# EAGLE design untitled (EAGLE 9.6.2)
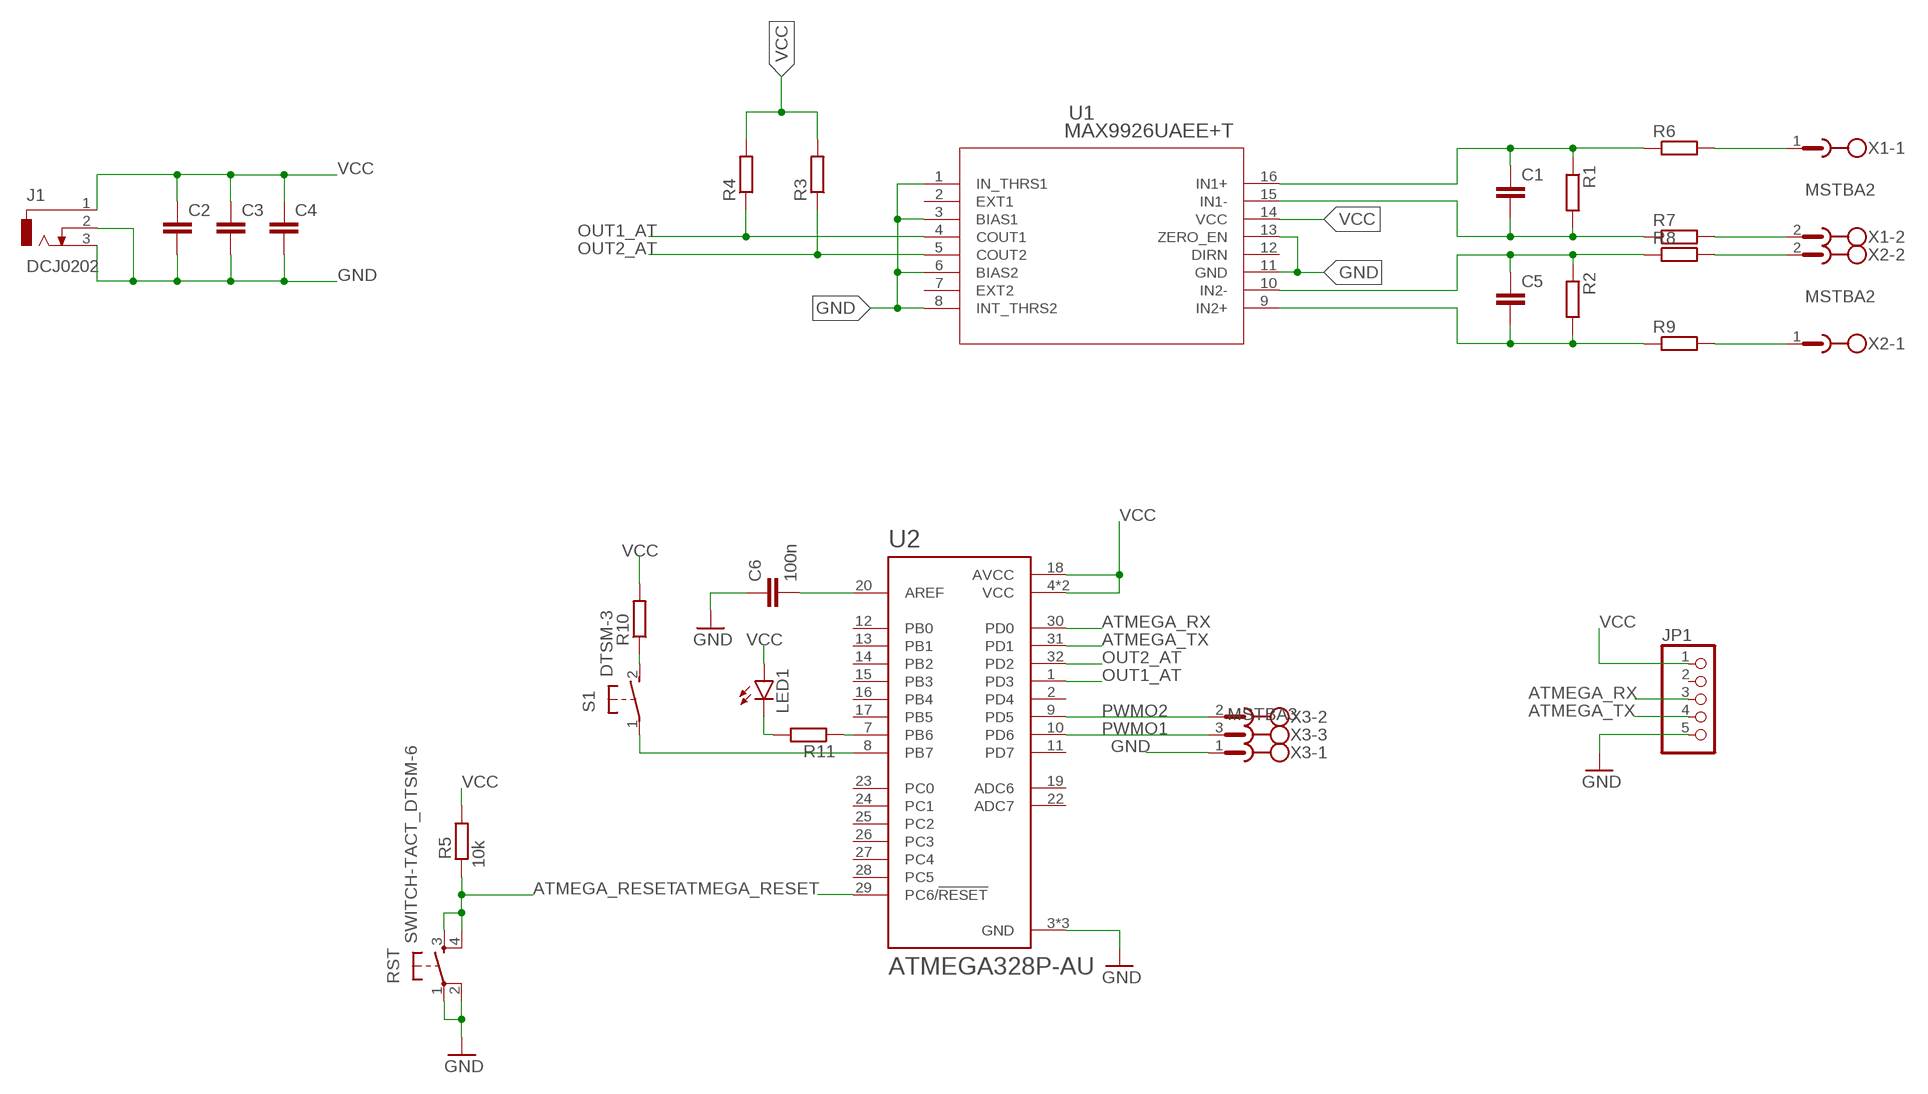
[diagram p0: schematic, sheet 1]

## Parts
C1  C-EUC0805  [C0805]
C2  C-EUC0805  [C0805]
C3  C-EUC0805  [C0805]
C4  C-EUC0805  [C0805]
C5  C-EUC0805  [C0805]
C6  100n  C-EUC0805  [C0805]
J1  DCJ0202  [DCJ0202]
JP1  PINHD-1X5  [1X05]
LED1  LEDCHIP-LED0805  [CHIP-LED0805]
R1  R-EU_R1206  [R1206]
R2  R-EU_R1206  [R1206]
R3  R-EU_R1206  [R1206]
R4  R-EU_R1206  [R1206]
R5  10k  R-EU_R1206  [R1206]
R6  R-EU_R2512  [R2512]
R7  R-EU_R2512  [R2512]
R8  R-EU_R2512  [R2512]
R9  R-EU_R2512  [R2512]
R10  R-EU_R1206  [R1206]
R11  R-EU_R1206  [R1206]
RST  SWITCH-TACT_DTSM-6  [SWITCH-TACT_DTSM-6]
S1  DTSM-3  [DTSM-3]
U1  MAX9926UAEE+T  [21-0055H_16_MXM]
U2  ATMEGA328P-AU  [QFP80P900X900X120-32N]
X1  MSTBA2  [MSTBA2]
X2  MSTBA2  [MSTBA2]
X3  MSTBA3  [MSTBA3]

## Nets
ATMEGA_RESET: R5.1 RST.3 RST.4 U2.29(PC6/!RESET)
ATMEGA_RX: JP1.3 U2.30(PD0)
ATMEGA_TX: JP1.4 U2.31(PD1)
GND: C2.2 C3.2 C4.2 C6.1 J1.2 J1.3 JP1.5 RST.1 RST.2 U1.1(IN_THRS1) U1.3(BIAS1) U1.6(BIAS2) U1.8(INT_THRS2) U1.11(GND) U1.13(ZERO_EN) U2.3(GND) U2.5(GND) U2.21(GND) X3.1
IN1+: R6.2 X1.1
IN1-: R7.2 X1.2
IN2+: R9.2 X2.1
IN2-: R8.2 X2.2
N$1: LED1.C R11.2
N$2: R10.1 S1.2
N$3: C1.1 R1.1 R6.1 U1.16(IN1+)
N$4: C1.2 R1.2 R7.1 U1.15(IN1-)
N$5: S1.1 U2.8(PB7)
N$6: C6.2 U2.20(AREF)
N$7: R11.1 U2.7(PB6)
N$8: C5.1 R2.1 R8.1 U1.10(IN2-)
N$9: C5.2 R2.2 R9.1 U1.9(IN2+)
OUT1_AT: R4.1 U1.4(COUT1) U2.1(PD3)
OUT2_AT: R3.1 U1.5(COUT2) U2.32(PD2)
PWMO1: U2.10(PD6) X3.3
PWMO2: U2.9(PD5) X3.2
VCC: C2.1 C3.1 C4.1 J1.1 JP1.1 LED1.A R3.2 R4.2 R5.2 R10.2 U1.14(VCC) U2.4(VCC) U2.6(VCC) U2.18(AVCC)
Unconnected: JP1.2 U1.2(EXT1) U1.7(EXT2) U1.12(DIRN) U2.2(PD4) U2.11(PD7) U2.12(PB0) U2.13(PB1) U2.14(PB2) U2.15(PB3) U2.16(PB4) U2.17(PB5) U2.19(ADC6) U2.22(ADC7) U2.23(PC0) U2.24(PC1) U2.25(PC2) U2.26(PC3) U2.27(PC4) U2.28(PC5)

## Library data of the parts
C1-C6 = rcl:C-EU: CAPACITOR, European symbol; SPICEPREFIX: C
J1 = con-jack:DCJ0202: DC POWER JACK Source: DCJ0202.pdf; OC_FARNELL: unknown; OC_NEWARK: unknown
JP1 = pinhead:PINHD-1X5: PIN HEADER
LED1 = led:LED: LED OSRAM: - CHIPLED LG R971, LG N971, LY N971, LG Q971, LY Q971, LO R971, LY R971 LH N974, LH R974 LS Q976, LO Q976, LY Q976 LO Q996 - Hyper CHIPLED LW Q18S LB Q993, LB Q99A, LB R99A - SideLED LS A670, LO A670, LY A670, LG A670, LP A670 LB A673, LV A673, LT A673, LW A673 LH A674 LY A675 LS A676, LA A676, LO A676, LY A676, LW A676 LS A679, LY A679, LG A679 - Hyper Micro SIDELED® LS Y876, LA Y876, LO Y876, LY Y876 LT Y87S - SmartLED LW L88C, LW L88S LB L89C, LB L89S, LG L890 LS L89K, LO L89K, LY L89K LS L896, LA L896, LO L896, LY L896 - TOPLED LS T670, LO T670, LY T670, LG T670, LP T670 LSG T670, LSP T670, LSY T670, LOP T670, LYG T670 LG T671, LOG T671, LSG T671 LB T673, LV T673, LT T673, LW T673 LH T674 LS T676, LA T676, LO T676, LY T676, LB T676, LH T676, LSB T676, LW T676 LB T67C, LV T67C, LT T67C, LS T67K, LO T67K, LY T67K, LW E67C LS E67B, LA E67B, LO E67B, LY E67B, LB E67C, LV E67C, LT E67C LW T67C LS T679, LY T679, LG T679 LS T770, LO T770, LY T770, LG T770, LP T770 LB T773, LV T773, LT T773, LW T773 LH T774 LS E675, LA E675, LY E675, LS T675 LS T776, LA T776, LO T776, LY T776, LB T776 LHGB T686 LT T68C, LB T68C - Hyper Mini TOPLED® LB M676 - Mini TOPLED Santana® LG M470 LS M47K, LO M47K, LY M47K Source: http://www.osram.convergy.de LUXEON: - LUMILED® LXK2-PW12-R00, LXK2-PW12-S00, LXK2-PW14-U00, LXK2-PW14-V00 LXK2-PM12-R00, LXK2-PM12-S00, LXK2-PM14-U00 LXK2-PE12-Q00, LXK2-PE12-R00, LXK2-PE12-S00, LXK2-PE14-T00, LXK2-PE14-U00 LXK2-PB12-K00, LXK2-PB12-L00, LXK2-PB12-M00, LXK2-PB14-N00, LXK2-PB14-P00, LXK2-PB14-Q00 LXK2-PR12-L00, LXK2-PR12-M00, LXK2-PR14-Q00, LXK2-PR14-R00 LXK2-PD12-Q00, LXK2-PD12-R00, LXK2-PD12-S00 LXK2-PH12-R00, LXK2-PH12-S00 LXK2-PL12-P00, LXK2-PL12-Q00, LXK2-PL12-R00 Source: www.luxeon.com KINGBRIGHT: KA-3528ASYC Source: www.kingbright.com
R1-R11 = rcl:R-EU_: RESISTOR, European symbol; SPICEPREFIX: R
RST = sensor_unit_V2.0:SWITCH-TACT_DTSM-6
S1 = switch-tact:DTSM-3
U1 = max9926:MAX9926UAEE+T; BUILT_BY: UL_Team_Molly; COPYRIGHT: Copyright (C) 2018 Accelerated Designs. All rights reserved; MANUFACTURER_PART_NUMBER: MAX9926UAEE+T; REVISION: 1; SOURCELIBRARY: Maxim_2018-10-24; VENDOR: Maxim Integrated Products
U2 = ATMEGA328P-AU:ATMEGA328P-AU: ATmega Series 20 MHz 32 KB Flash 2 KB SRAM 8-Bit Microcontroller - TQFP-32; AVAILABILITY: Unavailable; DESCRIPTION: AVR AVR® ATmega Microcontroller IC 8-Bit 20MHz 32KB (16K x 16) FLASH 32-TQFP (7x7); DIGIKEY-PURCHASE-URL: https://snapeda.com/shop?store=DigiKey&id=4703996; MF: Microchip Technology; MP: ATMEGA328P-AU; PACKAGE: TQFP-32 Microchip Technology; PRICE: None
X1 X2 = con-phoenix-508:MSTBA2: PHOENIX; MF: FARNELL; MPN: 1757242; OC_FARNELL: 3705171; OC_NEWARK: 71C4161
X3 = con-phoenix-508:MSTBA3: PHOENIX; MF: FARNELL; MPN: 1757255; OC_FARNELL: 3705183; OC_NEWARK: 71C4162

## Board
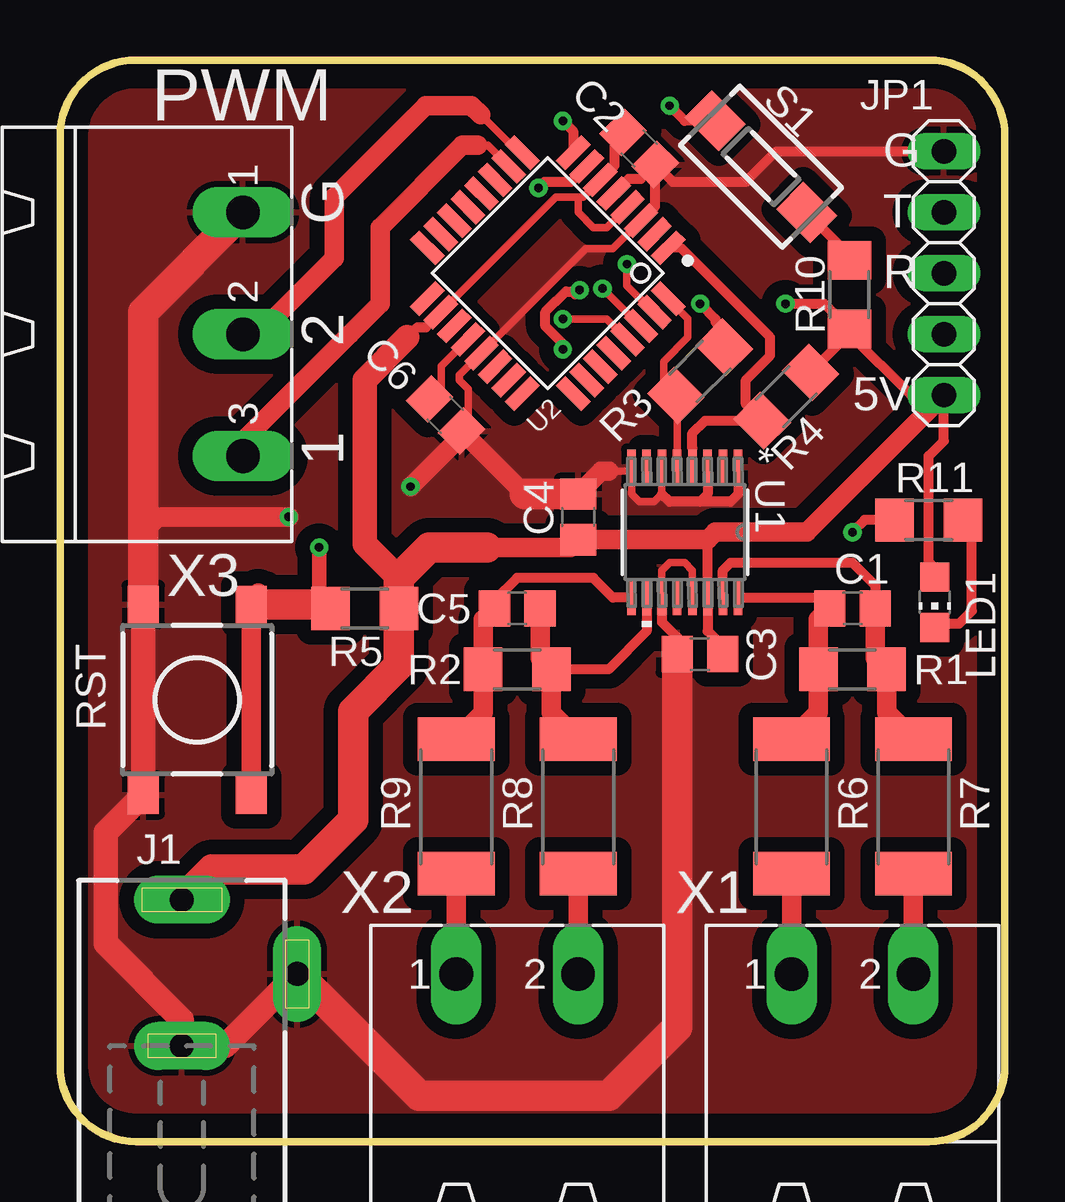
[diagram p1: board, top side]
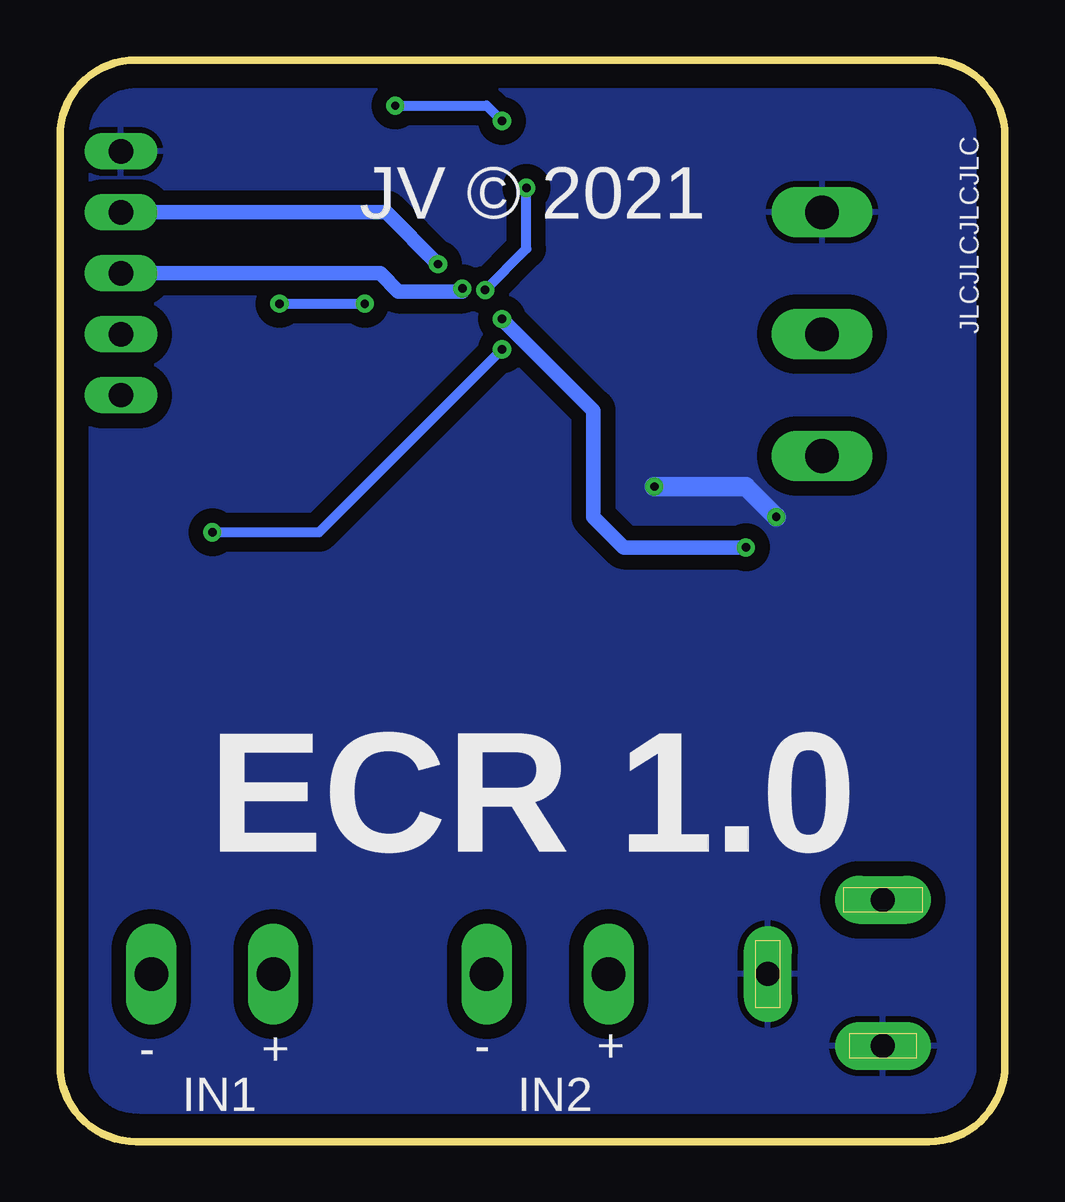
[diagram p2: board, bottom side, seen from below]

Size 39.37 x 45.09 mm. Coordinates in mm from the lower left corner, seen from the top.
Outline: 3.17,0 36.2,0
Outline: 0,41.91 0,3.17
Outline: 36.2,0 3.17,0
Outline: 0,3.17 0,41.91
Outline: 0,41.91 arc-90 3.17,45.09 36.2,45.09 arc-90 39.37,41.91 39.37,3.17 arc-90 36.2,0
Outline: 3.17,0 arc-90 0,3.17
Copper layers (1*16): Top 0.035mm / dielectric 1.5mm / Bottom 0.035mm
Design rules "default": minimum track width 6mil, minimum drill 0.35mm, track to track 6mil, track to pad 6mil, pad to pad 6mil, via to via 6mil, smd to smd 6mil, copper to edge 40mil, drill to drill 6mil, minimum pad ring 10mil, minimum via ring 8mil, stop-mask expansion 4mil, vias tented up to drill 0mil, thermal gap 10mil

### Footprints (pad centres in the part's own frame; a part is rotated, then mirrored left to right if it is on the bottom)
C0805 = smd 1.3 x 1.5: 1 -0.95,0; 2 0.95,0
DCJ0202 = drill 1 pad 2 long: 1 0,3.1; 2 4.8,0; 3 0,-3
1X05 = drill 1.016 long: 1 -5.08,0; 2 -2.54,0; 3 0,0; 4 2.54,0; 5 5.08,0
CHIP-LED0805 = smd 1.2 x 1.2: A 0,-1.05; C 0,1.05
R1206 = smd 1.6 x 1.803: 1 -1.422,0; 2 1.422,0
R2512 = smd 1.8 x 3.2: 1 -2.8,0; 2 2.8,0
SWITCH-TACT_DTSM-6 = smd 1.55 x 1.3: 1 -3.975,2.25; 2 3.975,2.25; 3 -3.975,-2.25; 4 3.975,-2.25
DTSM-3 = smd 2 x 1.6: 1 -2.7,0; 2 2.7,0
21-0055H_16_MXM = smd 1.455 x 0.355: 1 -2.721,2.223; 2 -2.721,1.587; 3 -2.721,0.953; 4 -2.721,0.318; 5 -2.721,-0.318; 6 -2.721,-0.953; 7 -2.721,-1.587; 8 -2.721,-2.223; 9 2.721,-2.223; 10 2.721,-1.587; 11 2.721,-0.953; 12 2.721,-0.318; 13 2.721,0.318; 14 2.721,0.953; 15 2.721,1.587; 16 2.721,2.223
QFP80P900X900X120-32N = smd 1.5 x 0.55: 1 -4.3,2.8; 2 -4.3,2; 3 -4.3,1.2; 4 -4.3,0.4; 5 -4.3,-0.4; 6 -4.3,-1.2; 7 -4.3,-2; 8 -4.3,-2.8; 17 4.3,-2.8; 18 4.3,-2; 19 4.3,-1.2; 20 4.3,-0.4; 21 4.3,0.4; 22 4.3,1.2; 23 4.3,2; 24 4.3,2.8 | smd 0.55 x 1.5: 9 -2.8,-4.3; 10 -2,-4.3; 11 -1.2,-4.3; 12 -0.4,-4.3; 13 0.4,-4.3; 14 1.2,-4.3; 15 2,-4.3; 16 2.8,-4.3; 25 2.8,4.3; 26 2,4.3; 27 1.2,4.3; 28 0.4,4.3; 29 -0.4,4.3; 30 -1.2,4.3; 31 -2,4.3; 32 -2.8,4.3
MSTBA2 = drill 1.397 long: 1 -2.54,5.08; 2 2.54,5.08
MSTBA3 = drill 1.397 long: 1 -5.08,5.08; 2 0,5.08; 3 5.08,5.08

### Placement (x,y rotation side)
C1  33.02,22.22 0 top
C2  24.13,41.4 315 top
C3  26.67,20.32 180 top
C4  21.59,26.04 90 top
C5  19.05,22.22 180 top
C6  16.06,30.29 135 top
J1  5.08,6.99 0 top
JP1  36.83,36.2 90 top
LED1  36.45,22.48 180 top
R1  33.02,19.68 0 top
R2  19.05,19.68 180 top
R3  26.67,32.11 45 top
R4  30.26,31.06 45 top
R5  12.7,22.22 0 top
R6  30.48,13.97 270 top
R7  35.56,13.97 270 top
R8  21.59,13.97 270 top
R9  16.51,13.97 270 top
R10  32.89,35.31 270 top
R11  36.2,25.91 0 top
RST  5.72,18.41 90 top
S1  29.21,40.64 315 top
U1  26.04,25.4 270 top
U2  20.32,36.2 225 top
X1  33.02,1.91 0 top
X2  19.05,1.91 0 top
X3  2.54,33.66 270 top

### Tracks (layer width: path | path; a pad name or v marks a point on that pad's centre or on a via)
ATMEGA_RESET  (via drill 0.35)
  Top 0.305: U2.29 22.79,34.29 v20.96,34.29
  Top 0.61: v10.8,24.77 10.8,22.71 11.11,22.39
  Top 0.813: RST.3 RST.4 | RST.4 7.97,22.57 8.25,22.86 8.25,22.68 RST.4
  Top 1.27: RST.4 11.11,22.39 R5.1
  Bottom 0.61: v20.96,34.29 17.14,30.48 17.14,26.04 15.88,24.77 v10.8,24.77
ATMEGA_RX  (via drill 0.35)
  Top 0.305: v22.61,35.56 24.16,34 U2.30
  Bottom 0.61: JP1.3 26.04,36.2 25.27,35.43 22.61,35.43 v22.61,35.56
ATMEGA_TX  (via drill 0.35)
  Top 0.305: v23.62,36.58 23.62,35.69 24.74,34.57 U2.31
  Bottom 0.61: v23.62,36.58 25.78,38.73 JP1.4
GND  (via drill 0.35)
  Top 0.305: U1.13 26.35,23.81 26.04,24.13 25.4,24.13 25.08,23.81 U1.11 | 22.86,27.94 23.63,27.94 U1.8 23.81,26.99 24.13,26.67 24.77,26.67 25.08,26.99 U1.6 | C6.1 17.02,29.91 17.02,31.37 16.64,31.75 16.64,31.95 U2.21 21.9,37.21 23.03,37.21 U2.3
  Top 0.406: U1.11 25.08,21.65 25.72,21.02 C3.2 | U1.1 28.26,26.99 27.94,26.67 26.67,26.67 | 25.08,26.99 25.4,26.67 26.67,26.67 | U1.3 26.99,26.99 26.67,26.67 | U2.5 23.69,40.13 24.2,40.13 C2.2 | U2.3 24.8,38.98 C2.2 | C2.2 25.53,40.01 28.57,40.01 29.84,41.28 JP1.5
  Top 0.813: C4.2 22.55,27.94 22.86,27.94 | 19.37,26.98 | 19.37,26.98 C6.1 16.73,29.43 v14.61,27.3 | 3.46,25.4 4.1,26.04 v9.52,26.04
  Top 1.016: J1.2 6.88,3.99 J1.3 5.08,5.08 1.91,8.25 1.91,12.88 RST.1 RST.2
  Top 1.27: J1.2 14.96,1.91 22.86,1.91 25.72,4.77 C3.2 | C4.2 19.37,26.98 | RST.2 3.46,25.4 3.46,34.58 X3.1
  Bottom 0.813: v9.52,26.04 10.8,27.3 v14.61,27.3
  pour Top (isolate 0.61): 0,45.09 39.37,45.09 39.37,0 0,0
  pour Bottom (isolate 0.61): 0,45.09 39.37,45.09 39.37,0 0,0
IN1+
  Top 0.813: X1.1 R6.2
IN1-
  Top 0.813: X1.2 R7.2
IN2+
  Top 0.813: X2.1 R9.2
IN2-
  Top 0.813: X2.2 R8.2
N$1
  Top 0.406: LED1.C 36.61,21.59 37.47,21.59 38,22.12 38,25.53 R11.2
N$2
  Top 0.406: S1.2 32.89,36.96 R10.1
N$3
  Top 0.406: U1.16 31.62,22.68 C1.1
  Top 0.813: R6.1 31.6,17.89 R1.1 31.6,21.75 C1.1
N$4
  Top 0.406: U1.15 27.62,23.81 27.94,24.13 33.02,24.13 33.97,23.18 C1.2
  Top 0.813: R7.1 34.44,17.89 R1.2 33.97,20.16 C1.2
N$5  (via drill 0.35)
  Top 0.406: S1.1 26.03,42.55 v25.4,43.18 | v20.96,42.55 21.38,42.12 U2.8
  Bottom 0.406: v25.4,43.18 21.59,43.18 v20.96,42.55
N$6
  Top 0.305: U2.20 15.88,32.32 15.88,31.45 C6.2
N$7  (via drill 0.35)
  Top 0.406: R11.1 33.53,25.91 v33.02,25.4 | v20.96,33.02 20.96,33.25 20.22,33.99 20.22,34.59 20.65,35.02 20.67,35.02 21.08,35.43 21.34,35.43 21.46,35.31 v21.65,35.5 | v19.94,39.75 20.19,40.01 21.3,40.01 U2.7
  Bottom 0.406: v33.02,25.4 28.57,25.4 v20.96,33.02 | v21.65,35.5 19.94,37.21 v19.94,39.75
N$8
  Top 0.406: U1.10 24.45,21.27 22.86,19.68 R2.1
  Top 0.813: R8.1 20.47,17.89 R2.1 20,20.16 C5.1
N$9
  Top 0.406: U1.9 23.04,22.68 22.23,23.5 19.05,23.5 18.1,22.54 C5.2
  Top 0.813: R9.1 17.63,17.89 R2.2 17.63,21.75 C5.2
OUT1_AT
  Top 0.305: U1.4 26.35,28.89 | 28.96,30.05 29.21,30.05 R4.1 | U2.1 25.4,37.26 25.86,37.26
  Top 0.406: 26.35,28.89 26.35,29.53 26.88,30.05 29.21,30.05 | R4.1 28.57,30.73 28.57,31.75 29.59,32.77 29.59,33.53 25.86,37.26 25.4,37.26
OUT2_AT
  Top 0.305: U1.5 25.72,31.05 R3.1 25.15,31.62 25.15,32.51 26.16,33.53 26.16,34.31 U2.32
PWMO1
  Top 0.305: U2.10 17.81,41.53 17.4,41.53
  Top 0.813: 17.4,41.53 16.76,41.53 13.34,38.1 13.34,34.93 12.07,33.66 7.62,29.21 X3.3
PWMO2
  Top 0.305: 17.53,42.8 19.11,41.22 U2.9
  Top 0.813: X3.2 8.25,33.66 11.43,36.83 11.43,39.37 15.24,43.18 17.14,43.18 17.53,42.8
VCC  (via drill 0.35)
  Top 0.305: 15.24,33.94 U2.18 20.67,39.37 21.59,39.37 | 23.5,42.11 C2.1 | U2.6 21.8,39.37 21.59,39.37 | U2.4 22.79,38.1 22.23,38.1 21.59,38.73 21.59,39.37
  Top 0.406: C3.1 27.62,20.64 26.99,21.27 U1.14 26.99,25.08 26.98,25.09 | 14.48,33.53 14.89,33.94 15.24,33.94 | 30.31,34.93 v30.23,34.93 31.85,34.93 R10.2 32.89,33.69 | R3.2 27.68,33.79 27.3,34.16 27.3,34.29 v26.67,34.93 | LED1.A 36.45,23.88 36.2,24.13 36.2,28.57 36.83,29.21 JP1.1 35.46,31.11 32.89,33.69 | R4.2 32.89,33.69 | U2.6 23.11,40.69 23.11,41.73 C2.1
  Top 0.813: 21.27,24.77 C4.1 | JP1.1 31.12,25.4 27.3,25.4 26.98,25.09 C4.1 | 17.78,24.77 21.27,24.77 | 21.27,24.77 C4.1
  Top 1.016: 14.12,23.5 12.7,24.92 12.7,31.75 14.48,33.53
  Top 1.27: J1.1 6.35,11.36 10.16,11.36 12.21,13.41 12.21,17.93 14.12,19.84 R5.2 14.12,23.5 15.39,24.77 17.78,24.77
  Bottom 0.406: 30.1,34.8 v30.23,34.93 v26.67,34.93

### Text on the board
tNames: PWM | G | G | T | R | 2 | 5V | 1
bNames: JLCJLCJLCJLC | JV © 2021 | ECR 1.0 | + | - | + | - | IN2 | IN1